# Altium schematic sheet Sheet1.SchDoc
size A4
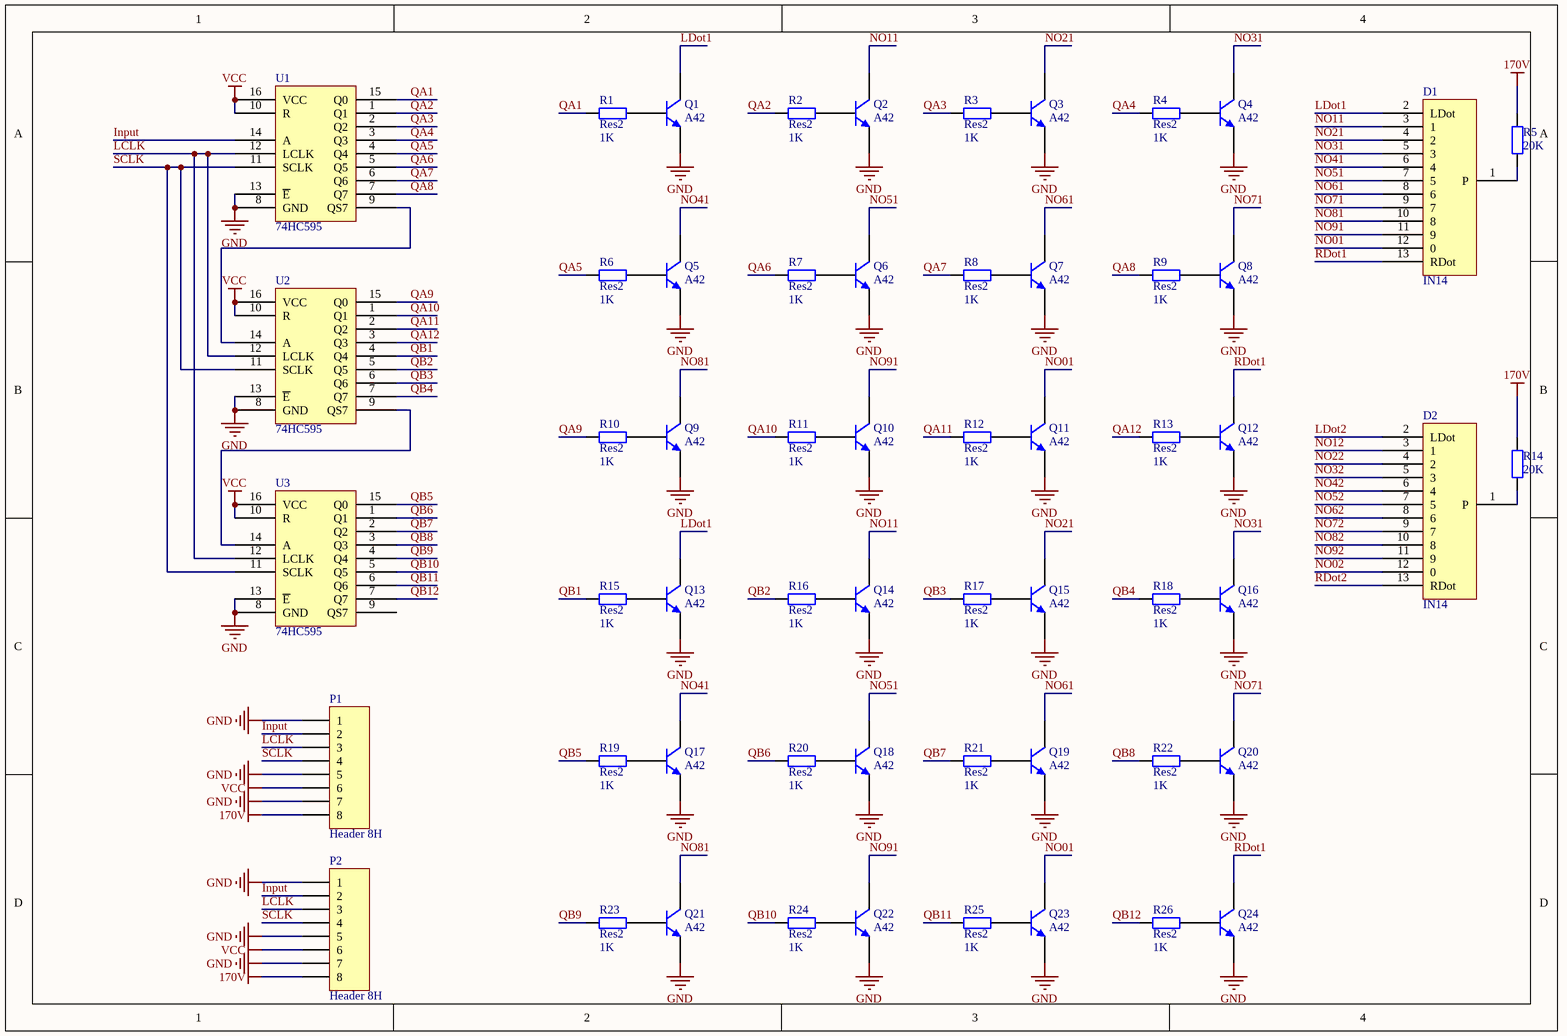
[diagram p0: Sheet1.SchDoc]

## Parts
D1  IN14  [IN14]
D2  IN14  [IN14]
P1  Header 8H  [HDR1X8H]
P2  Header 8H  [HDR1X8H]
Q1  A42  [SOT-23]
Q2  A42  [SOT-23]
Q3  A42  [SOT-23]
Q4  A42  [SOT-23]
Q5  A42  [SOT-23]
Q6  A42  [SOT-23]
Q7  A42  [SOT-23]
Q8  A42  [SOT-23]
Q9  A42  [SOT-23]
Q10  A42  [SOT-23]
Q11  A42  [SOT-23]
Q12  A42  [SOT-23]
Q13  A42  [SOT-23]
Q14  A42  [SOT-23]
Q15  A42  [SOT-23]
Q16  A42  [SOT-23]
Q17  A42  [SOT-23]
Q18  A42  [SOT-23]
Q19  A42  [SOT-23]
Q20  A42  [SOT-23]
Q21  A42  [SOT-23]
Q22  A42  [SOT-23]
Q23  A42  [SOT-23]
Q24  A42  [SOT-23]
R1  Res2  value 1K  [0805-0R]
R2  Res2  value 1K  [AXIAL-0.4]
R3  Res2  value 1K  [AXIAL-0.4]
R4  Res2  value 1K  [AXIAL-0.4]
R5  20K  [0805-0R]
R6  Res2  value 1K  [AXIAL-0.4]
R7  Res2  value 1K  [AXIAL-0.4]
R8  Res2  value 1K  [AXIAL-0.4]
R9  Res2  value 1K  [AXIAL-0.4]
R10  Res2  value 1K  [AXIAL-0.4]
R11  Res2  value 1K  [AXIAL-0.4]
R12  Res2  value 1K  [AXIAL-0.4]
R13  Res2  value 1K  [AXIAL-0.4]
R14  20K  [0805-0R]
R15  Res2  value 1K  [AXIAL-0.4]
R16  Res2  value 1K  [AXIAL-0.4]
R17  Res2  value 1K  [AXIAL-0.4]
R18  Res2  value 1K  [AXIAL-0.4]
R19  Res2  value 1K  [AXIAL-0.4]
R20  Res2  value 1K  [AXIAL-0.4]
R21  Res2  value 1K  [AXIAL-0.4]
R22  Res2  value 1K  [AXIAL-0.4]
R23  Res2  value 1K  [AXIAL-0.4]
R24  Res2  value 1K  [AXIAL-0.4]
R25  Res2  value 1K  [AXIAL-0.4]
R26  Res2  value 1K  [AXIAL-0.4]
U1  74HC595  [SOP16]
U2  74HC595  [SOP16]
U3  74HC595  [SOP16]

## Nets
170V: P1.8 P2.8 R5.2 R14.2
GND: P1.1 P1.5 P1.7 P2.1 P2.5 P2.7 Q1.1(E) Q2.1(E) Q3.1(E) Q4.1(E) Q5.1(E) Q6.1(E) Q7.1(E) Q8.1(E) Q9.1(E) Q10.1(E) Q11.1(E) Q12.1(E) Q13.1(E) Q14.1(E) Q15.1(E) Q16.1(E) Q17.1(E) Q18.1(E) Q19.1(E) Q20.1(E) Q21.1(E) Q22.1(E) Q23.1(E) Q24.1(E) U1.8(GND) U1.13(~{E}) U2.8(GND) U2.13(~{E}) U3.8(GND) U3.13(~{E})
VCC: P1.6 P2.6 U1.10(R) U1.16(VCC) U2.10(R) U2.16(VCC) U3.10(R) U3.16(VCC)
Input: P1.2 P2.2 U1.14(A)
LCLK: P1.3 P2.3 U1.12(LCLK) U2.12(LCLK) U3.12(LCLK)
LDot1: D1.2(LDot) Q1.3(C) Q13.3(C)
LDot2: D2.2(LDot)
NO01: D1.12(0) Q11.3(C) Q23.3(C)
NO02: D2.12(0)
NO11: D1.3(1) Q2.3(C) Q14.3(C)
NO12: D2.3(1)
NO21: D1.4(2) Q3.3(C) Q15.3(C)
NO22: D2.4(2)
NO31: D1.5(3) Q4.3(C) Q16.3(C)
NO32: D2.5(3)
NO41: D1.6(4) Q5.3(C) Q17.3(C)
NO42: D2.6(4)
NO51: D1.7(5) Q6.3(C) Q18.3(C)
NO52: D2.7(5)
NO61: D1.8(6) Q7.3(C) Q19.3(C)
NO62: D2.8(6)
NO71: D1.9(7) Q8.3(C) Q20.3(C)
NO72: D2.9(7)
NO81: D1.10(8) Q9.3(C) Q21.3(C)
NO82: D2.10(8)
NO91: D1.11(9) Q10.3(C) Q22.3(C)
NO92: D2.11(9)
QA1: R1.1 U1.15(Q0)
QA2: R2.1 U1.1(Q1)
QA3: R3.1 U1.2(Q2)
QA4: R4.1 U1.3(Q3)
QA5: R6.1 U1.4(Q4)
QA6: R7.1 U1.5(Q5)
QA7: R8.1 U1.6(Q6)
QA8: R9.1 U1.7(Q7)
QA9: R10.1 U2.15(Q0)
QA10: R11.1 U2.1(Q1)
QA11: R12.1 U2.2(Q2)
QA12: R13.1 U2.3(Q3)
QB1: R15.1 U2.4(Q4)
QB2: R16.1 U2.5(Q5)
QB3: R17.1 U2.6(Q6)
QB4: R18.1 U2.7(Q7)
QB5: R19.1 U3.15(Q0)
QB6: R20.1 U3.1(Q1)
QB7: R21.1 U3.2(Q2)
QB8: R22.1 U3.3(Q3)
QB9: R23.1 U3.4(Q4)
QB10: R24.1 U3.5(Q5)
QB11: R25.1 U3.6(Q6)
QB12: R26.1 U3.7(Q7)
RDot1: D1.13(RDot) Q12.3(C) Q24.3(C)
RDot2: D2.13(RDot)
SCLK: P1.4 P2.4 U1.11(SCLK) U2.11(SCLK) U3.11(SCLK)
NetD1_1: D1.1(P) R5.1
NetD2_1: D2.1(P) R14.1
NetQ1_2: Q1.2(B) R1.2
NetQ2_2: Q2.2(B) R2.2
NetQ3_2: Q3.2(B) R3.2
NetQ4_2: Q4.2(B) R4.2
NetQ5_2: Q5.2(B) R6.2
NetQ6_2: Q6.2(B) R7.2
NetQ7_2: Q7.2(B) R8.2
NetQ8_2: Q8.2(B) R9.2
NetQ9_2: Q9.2(B) R10.2
NetQ10_2: Q10.2(B) R11.2
NetQ11_2: Q11.2(B) R12.2
NetQ12_2: Q12.2(B) R13.2
NetQ13_2: Q13.2(B) R15.2
NetQ14_2: Q14.2(B) R16.2
NetQ15_2: Q15.2(B) R17.2
NetQ16_2: Q16.2(B) R18.2
NetQ17_2: Q17.2(B) R19.2
NetQ18_2: Q18.2(B) R20.2
NetQ19_2: Q19.2(B) R21.2
NetQ20_2: Q20.2(B) R22.2
NetQ21_2: Q21.2(B) R23.2
NetQ22_2: Q22.2(B) R24.2
NetQ23_2: Q23.2(B) R25.2
NetQ24_2: Q24.2(B) R26.2
NetU1_9: U1.9(QS7) U2.14(A)
NetU2_9: U2.9(QS7) U3.14(A)

Not connected (* = marked no-connect by the designer): U3 9(QS7)

## Library data of the parts
P1 P2 = Header 8H: Header, 8-Pin, Right Angle; LatestRevisionDate: 17-Jul-2002; LatestRevisionNote: Re-released for DXP Platform.; Publisher: Altium Limited
Q1-Q24 = 2N3904: NPN General Purpose Amplifier; Published: 8-Jun-2000; LatestRevisionDate: 15-Jan-2003; LatestRevisionNote: PCB Footprint 'BCY-W3/D4.7' replaced; DatasheetVersion: 1997; PackageVersion: Sep-1998; PackageReference: TO-92A; Publisher: Altium Limited; PackageDescription: TO, Flat Index; 3 In-Line, Axial Leads; Body Dia. 4.5mm; Leads 0.51 x 0.48 mm (max); ComponentLink1Description: Manufacturer Link; ComponentLink1URL: http://www.fairchildsemi.com/; ComponentLink2Description: Datasheet; ComponentLink2URL: http://www.fairchildsemi.com/ds/2N%2F2N3904.pdf
R1-R26 = Res2: Resistor; Published: 8-Jun-2000; LatestRevisionDate: 17-Jul-2002; LatestRevisionNote: Re-released for DXP Platform.; PackageReference: AXIAL-0.4; Publisher: Altium Limited; PackageDescription: Axial Device, Thru-Hole; 2 Leads; 0.4 in Pin Spacing